# Altium schematic sheet ANALOG_PART2.SchDoc
size A3; SheetNumber: 2; SheetTotal: 3
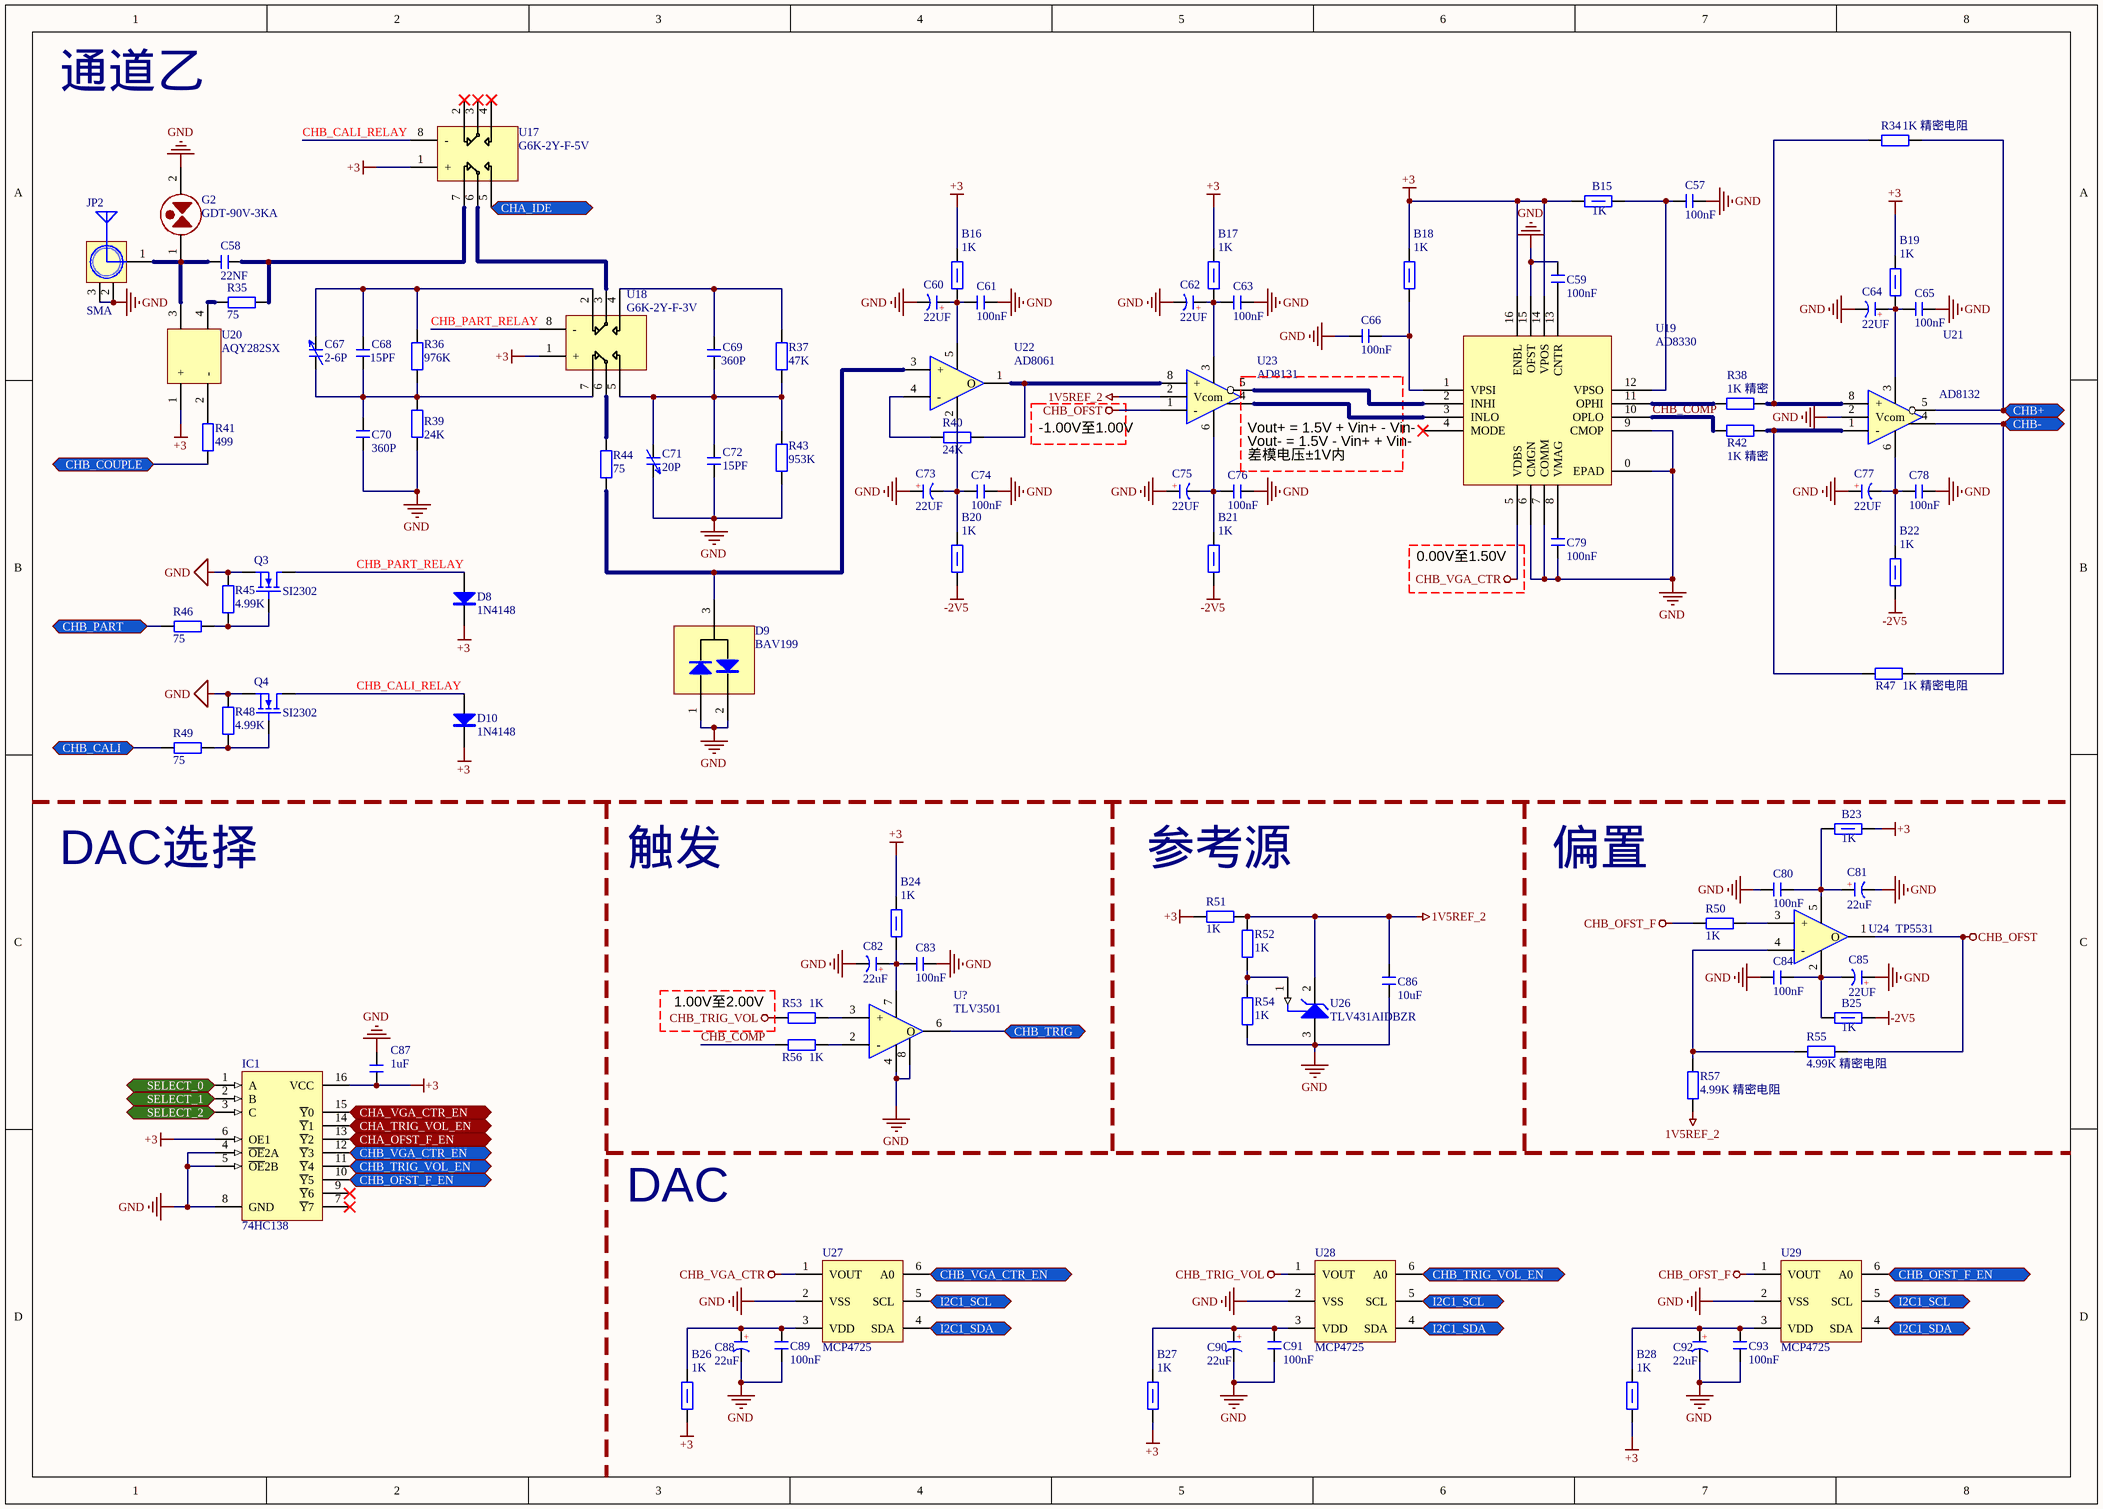
[diagram p0: ANALOG_PART2.SchDoc]

## Parts
B15  1K  [B 0603_L]
B16  1K  [B 0603_L]
B17  1K  [B 0603_L]
B18  1K  [B 0603_L]
B19  1K  [B 0603_L]
B20  1K  [B 0603_L]
B21  1K  [B 0603_L]
B22  1K  [B 0603_L]
B23  1K  [B 0603_L]
B24  1K  [B 0603_L]
B25  1K  [B 0603_L]
B26  1K  [B 0603_L]
B27  1K  [B 0603_L]
B28  1K  [B 0603_L]
C57  100nF  [C 0603_L]
C58  22NF  [C 1206_L]
C59  100nF  [C 0603_L]
C60  22UF  [C 0603_L]
C61  100nF  [C 0603_L]
C62  22UF  [C 0603_L]
C63  100nF  [C 0603_L]
C64  22UF  [C 0603_L]
C65  100nF  [C 0603_L]
C66  100nF  [C 0603_L]
C67  2-6P  [RC-SMD]
C68  15PF  [C 0603_L]
C69  360P  [C 0603_L]
C70  360P  [C 0603_L]
C71  20P  [RC-SMD]
C72  15PF  [C 0603_L]
C73  22UF  [C 0603_L]
C74  100nF  [C 0603_L]
C75  22UF  [C 0603_L]
C76  100nF  [C 0603_L]
C77  22UF  [C 0603_L]
C78  100nF  [C 0603_L]
C79  100nF  [C 0603_L]
C80  100nF  [C 0603_L]
C81  22uF  [C 0603_L]
C82  22uF  [C 0603_L]
C83  100nF  [C 0603_L]
C84  100nF  [C 0603_L]
C85  22UF  [C 0603_L]
C86  10uF  [C 0603_L]
C87  1uF  [C 0603_L]
C88  22uF  [C 0603_L]
C89  100nF  [C 0603_L]
C90  22uF  [C 0603_L]
C91  100nF  [C 0603_L]
C92  22uF  [C 0603_L]
C93  100nF  [C 0603_L]
D8  1N4148  [SOD-523_L]
D9  BAV199  [SOT23-3L]
D10  1N4148  [SOD-523_L]
G2  GDT-90V-3KA  [GDT-1812]
IC1  74HC138  [TSSOP16_L]
JP2  SMA  [SMA_FR]
Q3  SI2302  [SOT23-3L]
Q4  SI2302  [SOT23-3L]
R34  1K 精密电阻  [R 0603_L]
R35  75  [R 0603_L]
R36  976K  [R 0603_L]
R37  47K  [R 0603_L]
R38  1K 精密  [R 0603_L]
R39  24K  [R 0603_L]
R40  24K  [R 0603_L]
R41  499  [R 0603_L]
R42  1K 精密  [R 0603_L]
R43  953K  [R 0603_L]
R44  75  [R 0603_L]
R45  4.99K  [R 0603_L]
R46  75  [R 0603_L]
R47  1K 精密电阻  [R 0603_L]
R48  4.99K  [R 0603_L]
R49  75  [R 0603_L]
R50  1K  [R 0603_L]
R51  1K  [R 0603_L]
R52  1K  [R 0603_L]
R53  1K  [R 0603_L]
R54  1K  [R 0603_L]
R55  4.99K 精密电阻  [R 0603_L]
R56  1K  [R 0603_L]
R57  4.99K 精密电阻  [R 0603_L]
U17  G6K-2Y-F-5V  [G6K-2F-Y]
U18  G6K-2Y-F-3V  [G6K-2F-Y]
U19  AD8330  [LFCSP-16]
U20  AQY282SX  [SOP4_L]
U21  AD8132  [SOP8_L]
U22  AD8061  [SOT23-5]
U23  AD8131  [SOP8_L]
U24  TP5531  [SOT23-5]
U26  TLV431AIDBZR  [DBZ0003A_N]
U27  MCP4725  [SOT23-6L]
U28  MCP4725  [SOT23-6L]
U29  MCP4725  [SOT23-6L]
U?  TLV3501  [SOP8_L]

## Ports
CHA_IDE (bidir), CHA_OFST_F_EN (bidir), CHA_TRIG_VOL_EN (bidir), CHA_VGA_CTR_EN (bidir), CHB+ (bidir), CHB- (bidir), CHB_CALI (bidir), CHB_COUPLE (bidir), CHB_OFST_F_EN (bidir), CHB_PART (bidir), CHB_TRIG (bidir), CHB_TRIG_VOL_EN (bidir), CHB_VGA_CTR_EN (bidir), I2C1_SCL (bidir), I2C1_SDA (bidir), SELECT_0 (bidir), SELECT_1 (bidir), SELECT_2 (bidir)

## Nets
1V5REF_2: C86.1 R51.2 R52.2 R57.2 U23.2(Vcom) U26.2(CATHODE)
+3: B15.1 B16.2 B17.2 B18.2 B19.2 B23.2 B24.2 B26.1 B27.1 B28.1 C87.2 D8.2(K) D10.2(K) IC1.6(OE1) IC1.16(VCC) R51.1 U17.1(+) U18.1(+) U19.14(VPOS) U19.16(ENBL) U20.1(+)
-2V5: B20.1 B21.1 B22.1 B25.2
CHB_OFST: R55.2 U23.1(-) U24.1(O)
CHB_OFST_F: R50.2 U29.1(VOUT)
CHB_TRIG_VOL: R53.1 U28.1(VOUT)
CHB_VGA_CTR: U19.5(VDBS) U27.1(VOUT)
GND: C57.1 C59.1 C60.2(K) C61.1 C62.2(K) C63.1 C64.2(K) C65.1 C66.2 C70.1 C71.2 C72.1 C73.1(A) C74.1 C75.1(A) C76.1 C77.1(A) C78.1 C79.2 C80.2 C81.2(K) C82.2(K) C83.1 C84.2 C85.1(A) C86.2 C87.1 C88.2(K) C89.2 C90.2(K) C91.2 C92.2(K) C93.2 D9.1 D9.2 G2.2 IC1.4(~{OE}2A) IC1.5(~{OE}2B) IC1.8(GND) JP2.2(GND) JP2.3(GND) Q3.2 Q4.2 R39.1 R43.1 R45.2 R48.2 R54.1 U19.0(EPAD) U19.6(CMGN) U19.7(COMM) U19.9(CMOP) U19.15(OFST) U21.2(Vcom) U26.3(ANODE) U27.2(VSS) U28.2(VSS) U29.2(VSS) U?.4 U?.8
CHA_IDE: U17.5 ; port CHA_IDE
CHA_OFST_F_EN: IC1.13(~{Y}2) ; port CHA_OFST_F_EN
CHA_TRIG_VOL_EN: IC1.14(~{Y}1) ; port CHA_TRIG_VOL_EN
CHA_VGA_CTR_EN: IC1.15(~{Y}0) ; port CHA_VGA_CTR_EN
CHB+: R34.2 U21.5 ; port CHB+
CHB-: R47.2 U21.4 ; port CHB-
CHB_CALI: R49.2 ; port CHB_CALI
CHB_CALI_RELAY: D10.1(A) Q4.3 U17.8(-)
CHB_COMP: R42.1 R56.1 U19.10(OPLO)
CHB_COUPLE: R41.1 ; port CHB_COUPLE
CHB_OFST_F_EN: IC1.10(~{Y}5) U29.6(A0) ; port CHB_OFST_F_EN
CHB_PART: R46.2 ; port CHB_PART
CHB_PART_RELAY: D8.1(A) Q3.3 U18.8(-)
CHB_TRIG: U?.6(O) ; port CHB_TRIG
CHB_TRIG_VOL_EN: IC1.11(~{Y}4) U28.6(A0) ; port CHB_TRIG_VOL_EN
CHB_VGA_CTR_EN: IC1.12(~{Y}3) U27.6(A0) ; port CHB_VGA_CTR_EN
I2C1_SCL: U27.5(SCL) U28.5(SCL) U29.5(SCL) ; port I2C1_SCL
I2C1_SDA: U27.4(SDA) U28.4(SDA) U29.4(SDA) ; port I2C1_SDA
SELECT_0: IC1.1(A) ; port SELECT_0
SELECT_1: IC1.2(B) ; port SELECT_1
SELECT_2: IC1.3(C) ; port SELECT_2
NetB15_2: B15.2 C57.2 U19.12(VPSO)
NetB16_1: B16.1 C60.1(A) C61.2 U22.5
NetB17_1: B17.1 C62.1(A) C63.2 U23.3
NetB18_1: B18.1 C66.1 U19.1(VPSI)
NetB19_1: B19.1 C64.1(A) C65.2 U21.3
NetB20_2: B20.2 C73.2(K) C74.2 U22.2
NetB21_2: B21.2 C75.2(K) C76.2 U23.6
NetB22_2: B22.2 C77.2(K) C78.2 U21.6
NetB23_1: B23.1 C80.1 C81.1(A) U24.5
NetB24_1: B24.1 C82.1(A) C83.2 U?.7
NetB25_1: B25.1 C84.1 C85.2(K) U24.2
NetB26_2: B26.2 C88.1(A) C89.1 U27.3(VDD)
NetB27_2: B27.2 C90.1(A) C91.1 U28.3(VDD)
NetB28_2: B28.2 C92.1(A) C93.1 U29.3(VDD)
NetC58_1: C58.1 G2.1 JP2.1(ANT) U20.3
NetC58_2: C58.2 R35.2 U17.7
NetC59_2: C59.2 U19.13(CNTR)
NetC67_1: C67.1 C68.1 C70.2 R36.1 R39.2 U18.7
NetC67_2: C67.2 C68.2 R36.2 U18.2
NetC69_1: C69.1 C71.1 C72.2 R37.1 R43.2 U18.5
NetC69_2: C69.2 R37.2 U18.4
NetC79_1: C79.1 U19.8(VMAG)
NetD9_3: D9.3 R44.1 U22.3(+)
NetQ3_1: Q3.1 R45.1 R46.1
NetQ4_1: Q4.1 R48.1 R49.1
NetR34_1: R34.1 R38.2 U21.8(+)
NetR35_1: R35.1 U20.4
NetR38_1: R38.1 U19.11(OPHI)
NetR40_1: R40.1 U22.1(O) U23.8(+)
NetR40_2: R40.2 U22.4(-)
NetR41_2: R41.2 U20.2(-)
NetR42_2: R42.2 R47.1 U21.1(-)
NetR44_2: R44.2 U18.6
NetR50_1: R50.1 U24.3(+)
NetR52_1: R52.1 R54.2 U26.1(REF)
NetR53_2: R53.2 U?.3(+)
NetR55_1: R55.1 R57.1 U24.4(-)
NetR56_2: R56.2 U?.2(-)
NetU17_6: U17.6 U18.3
NetU19_2: U19.2(INHI) U23.5
NetU19_3: U19.3(INLO) U23.4

Not connected (* = marked no-connect by the designer): IC1 7(~{Y}7)* 9(~{Y}6)*; U17 2* 3* 4*; U19 4(MODE)*

## Notes on the sheet
- 通道乙
- -1.00V至1.00V
- Vout+ = 1.5V + Vin+ - Vin-
- Vout- = 1.5V - Vin+ + Vin-
- 差模电压±1V内
- 0.00V至1.50V
- DAC选择
- 触发
- 参考源
- 偏置
- 1.00V至2.00V
- DAC
- (in symbol C-CD) +

## Library data of the parts
B15-B28 = B: 贴片磁珠
C57-C59 C61 C63 C65 C66 C68-C70 C72 C74 C76 C78-C80 C83 C84 C86 C87 C89 C91 C93 = C: 无极性贴片电容; 版权归属: 源创客; BOM名称: 无极性贴片电容; 学习资源: www.ooocke.com
C60 C62 C64 C73 C75 C77 C81 C82 C85 C88 C90 C92 = C-CD: 贴片钽电容; 版权归属: 源创客; BOM名称: 贴片钽电容; 学习资源: www.ooocke.com
C67 C71 = CP_SMD: 贴片可调电容
D8 D10 = 1N4148: 高速开关二极管; 版权归属: 源创客; BOM名称: 高速开关二极管; 学习资源: www.ooocke.com
D9 = BAV199: 双肖特基二极管; BOM名称: 肖特基二极管; 版权归属: 源创客; 属性: 40V/2A; 学习资源: www.ooocke.com
G2 = GDT-90V-3KA: 气体放电管
IC1 = 74HC138: 138译码器; 版权归属: 源创客; 学习资源: www.ooocke.com; BOM名称: 138译码器
JP2 = SMA: SMA-2.4G射频天线接口; 版权归属: 源创客; BOM名称: SMA-2.4G射频天线接口; 学习资源: www.ooocke.com
Q3 Q4 = SI2302: 场效应管
R34-R57 = R: 贴片电阻; 版权归属: 源创客; BOM名称: 贴片电阻; 学习资源: www.ooocke.com
U17 U18 = G6K-2Y-F-5V: 继电器
U19 = AD8330: 压控放大器
U20 = AQY282SX: 光电固态继电器
U21 = AD8132: 全差分运放; BOM名称: 单路精密运放; 版权归属: 源创客; 学习资源: www.ooocke.com
U22 = AD8061: FET输入运放; BOM名称: 单路精密运放; 版权归属: 源创客; 学习资源: www.ooocke.com
U23 = AD8131: 全差分运放; BOM名称: 单路精密运放; 版权归属: 源创客; 学习资源: www.ooocke.com
U24 = TP5531: 零漂运放; BOM名称: 单路精密运放; 版权归属: 源创客; 学习资源: www.ooocke.com
U26 = CMP-0366-00975-2: Low Voltage Adjustable Precision Shunt Regulator, 39 ppm / degC, 15 mA, -40 to 85 degC, 3-pin SOT-23 (DBZ), Green (RoHS & no Sb/Br); Manufacturer: Texas Instruments; Temp Coeff(Typ)(ppm/ degree C): 39; VO Adj(Max)(V): 6; SubFamily: Shunt Voltage Reference; Min Iz for Regulation(uA): 80; Temp Coeff(Max)(ppm/ degree C): 129; VO Adj(Min)(V): 1.24; Initial Accuracy @ 25/deg C(%): 1; Iout/Iz(Max)(mA): 15; Rating: Catalog; ComponentLink1URL: http://www.ti.com/; ComponentLink2URL: http://www.ti.com/general/docs/lit/getliterature.tsp?genericPartNumber=TLV431A&fileType=pdf; Mounting Technology: Surface Mount; DatasheetVersion: SLVS139T; ComponentLink3URL: http://www.ti.com/litv/pdf/mpds108a; PackageDescription: 3-Pin Plastic Small Outline, Body 2.92 x 1.3 mm, Pitch 0.95 mm; Code_JEDEC: TO-236; Eco-Plan: Green (RoHS & no Sb/Br); ComponentLink2Description: Datasheet; PackageReference: DBZ0003A; PackageVersion: 4203227/B; ComponentLink3Description: Package Specification; PartNumber: TLV431AIDBZR; ComponentLink1Description: Manufacturer URL
U27-U29 = MCP4725: 单通道DAC
U? = TLV3501: 高速比较器; BOM名称: 单路精密运放; 版权归属: 源创客; 学习资源: www.ooocke.com